# Altium schematic sheet Igniter Outputs.SchDoc: Ravage - Igniter Outputs
size A4; Address1: Drawn By:; Address2: Dan Visser; DocumentNumber: A; Revision: 0.2; SheetNumber: 10; SheetTotal: 15
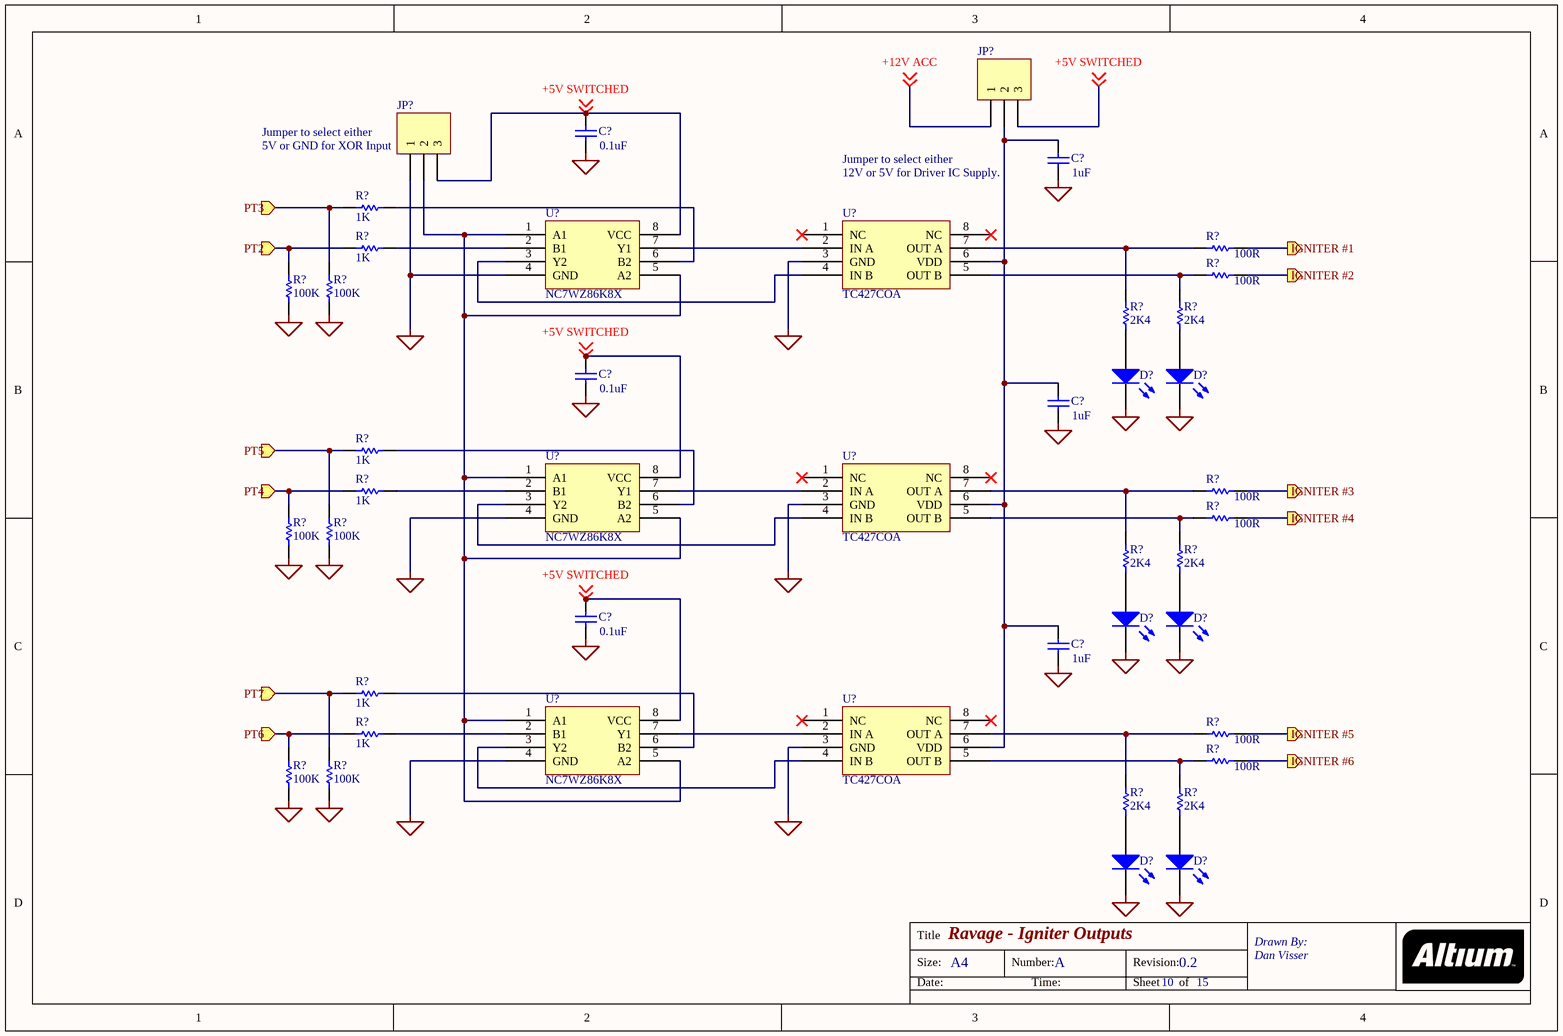
[diagram p0: Igniter Outputs.SchDoc]

## Parts
(Parts that share a designator on the sheet are numbered #1, #2 ... from top to bottom, then left to right.)
C?#1  value 0.1uF  [RAD-0.3]
C?#2  value 1uF  [RAD-0.3]
C?#3  value 0.1uF  [RAD-0.3]
C?#4  value 1uF  [RAD-0.3]
C?#5  value 0.1uF  [RAD-0.3]
C?#6  value 1uF  [RAD-0.3]
D?#1  (no value)  [LED-0]
D?#2  (no value)  [LED-0]
D?#3  (no value)  [LED-0]
D?#4  (no value)  [LED-0]
D?#5  (no value)  [LED-0]
D?#6  (no value)  [LED-0]
JP?#1  (no value)  [HDR1X3]
JP?#2  (no value)  [HDR1X3]
R?#1  value 1K  [AXIAL-0.3]
R?#2  value 100R  [AXIAL-0.3]
R?#3  value 1K  [AXIAL-0.3]
R?#4  value 100R  [AXIAL-0.3]
R?#5  value 100K  [AXIAL-0.3]
R?#6  value 100K  [AXIAL-0.3]
R?#7  value 2K4  [AXIAL-0.3]
R?#8  value 2K4  [AXIAL-0.3]
R?#9  value 1K  [AXIAL-0.3]
R?#10  value 100R  [AXIAL-0.3]
R?#11  value 1K  [AXIAL-0.3]
R?#12  value 100R  [AXIAL-0.3]
R?#13  value 100K  [AXIAL-0.3]
R?#14  value 100K  [AXIAL-0.3]
R?#15  value 2K4  [AXIAL-0.3]
R?#16  value 2K4  [AXIAL-0.3]
R?#17  value 1K  [AXIAL-0.3]
R?#18  value 100R  [AXIAL-0.3]
R?#19  value 1K  [AXIAL-0.3]
R?#20  value 100R  [AXIAL-0.3]
R?#21  value 100K  [AXIAL-0.3]
R?#22  value 100K  [AXIAL-0.3]
R?#23  value 2K4  [AXIAL-0.3]
R?#24  value 2K4  [AXIAL-0.3]
U?#1  TC427COA
U?#2  NC7WZ86K8X
U?#3  TC427COA
U?#4  NC7WZ86K8X
U?#5  TC427COA
U?#6  NC7WZ86K8X

## Ports
IGNITER #1 (out), IGNITER #2 (out), IGNITER #3 (out), IGNITER #4 (out), IGNITER #5 (out), IGNITER #6 (out), PT2 (in), PT3 (in), PT4 (in), PT5 (in), PT6 (in), PT7 (in)

## Nets
NetC?#1_1: C?#1.1 C?#2.1 C?#3.1 C?#4.1 C?#5.1 C?#6.1 D?#1.2(K) D?#2.2(K) D?#3.2(K) D?#4.2(K) D?#5.2(K) D?#6.2(K) JP?#2.1 R?#5.1 R?#6.1 R?#13.1 R?#14.1 R?#21.1 R?#22.1 U?#1.3(GND) U?#2.4(GND) U?#3.3(GND) U?#4.4(GND) U?#5.3(GND) U?#6.4(GND)
+5V SWITCHED: C?#1.2 C?#3.2 C?#5.2 JP?#1.3 JP?#2.3 U?#2.8(VCC) U?#4.8(VCC) U?#6.8(VCC) ; off-sheet +5V SWITCHED
+12V ACC: JP?#1.1 ; off-sheet +12V ACC
IGNITER #1: R?#2.2 ; port IGNITER #1
IGNITER #2: R?#4.2 ; port IGNITER #2
IGNITER #3: R?#10.2 ; port IGNITER #3
IGNITER #4: R?#12.2 ; port IGNITER #4
IGNITER #5: R?#18.2 ; port IGNITER #5
IGNITER #6: R?#20.2 ; port IGNITER #6
PT2: R?#3.2 R?#5.2 ; port PT2
PT3: R?#1.2 R?#6.2 ; port PT3
PT4: R?#11.2 R?#13.2 ; port PT4
PT5: R?#9.2 R?#14.2 ; port PT5
PT6: R?#19.2 R?#21.2 ; port PT6
PT7: R?#17.2 R?#22.2 ; port PT7
NetC?#2_2: C?#2.2 C?#4.2 C?#6.2 JP?#1.2 U?#1.6(VDD) U?#3.6(VDD) U?#5.6(VDD)
NetD?#1_1: D?#1.1(A) R?#7.1
NetD?#2_1: D?#2.1(A) R?#8.1
NetD?#3_1: D?#3.1(A) R?#15.1
NetD?#4_1: D?#4.1(A) R?#16.1
NetD?#5_1: D?#5.1(A) R?#23.1
NetD?#6_1: D?#6.1(A) R?#24.1
NetJP?#2_2: JP?#2.2 U?#2.1(A1) U?#2.5(A2) U?#4.1(A1) U?#4.5(A2) U?#6.1(A1) U?#6.5(A2)
NetR?#1_1: R?#1.1 U?#2.6(B2)
NetR?#2_1: R?#2.1 R?#7.2 U?#1.7(OUT_A)
NetR?#3_1: R?#3.1 U?#2.2(B1)
NetR?#4_1: R?#4.1 R?#8.2 U?#1.5(OUT_B)
NetR?#9_1: R?#9.1 U?#4.6(B2)
NetR?#10_1: R?#10.1 R?#15.2 U?#3.7(OUT_A)
NetR?#11_1: R?#11.1 U?#4.2(B1)
NetR?#12_1: R?#12.1 R?#16.2 U?#3.5(OUT_B)
NetR?#17_1: R?#17.1 U?#6.6(B2)
NetR?#18_1: R?#18.1 R?#23.2 U?#5.7(OUT_A)
NetR?#19_1: R?#19.1 U?#6.2(B1)
NetR?#20_1: R?#20.1 R?#24.2 U?#5.5(OUT_B)
NetU?#1_2: U?#1.2(IN_A) U?#2.7(Y1)
NetU?#1_4: U?#1.4(IN_B) U?#2.3(Y2)
NetU?#3_2: U?#3.2(IN_A) U?#4.7(Y1)
NetU?#3_4: U?#3.4(IN_B) U?#4.3(Y2)
NetU?#5_2: U?#5.2(IN_A) U?#6.7(Y1)
NetU?#5_4: U?#5.4(IN_B) U?#6.3(Y2)

Not connected (* = marked no-connect by the designer): U?#1 1(NC)* 8(NC)*; U?#3 1(NC)* 8(NC)*; U?#5 1(NC)* 8(NC)*

## Notes on the sheet
- (near JP?#2) Jumper to select either
- (near JP?#2) 5V or GND for XOR Input
- Jumper to select either
- (near C?#2) 12V or 5V for Driver IC Supply.
- Title
- Size:
- Date:
- A4
- Number:
- Time:
- Revision:
- Sheet
- of

## Library data of the parts
C?#1-C?#6 = Cap: Capacitor; Published: 8-Jun-2000; LatestRevisionDate: 17-Jul-2002; LatestRevisionNote: Re-released for DXP Platform.; PackageReference: RAD-0.3; Publisher: Altium Limited; PackageDescription: Radial Cap, Thru-Hole; 2 Leads; 0.3 in Pin Spacing
D?#1-D?#6 = LED0: Typical INFRARED GaAs LED; Published: 8-Jun-2000; LatestRevisionDate: 08-Jul-2005; LatestRevisionNote: Mech Layer 1 removed.; PackageReference: LED-0; Publisher: Altium Limited; PackageDescription: LED; 2 Leads
JP?#1 JP?#2 = Header 3: Header, 3-Pin; LatestRevisionDate: 17-Jul-2002; LatestRevisionNote: Re-released for DXP Platform.; Publisher: Altium Limited
R?#1-R?#24 = Res1: Resistor; Published: 8-Jun-2000; LatestRevisionDate: 17-Jul-2002; LatestRevisionNote: Re-released for DXP Platform.; PackageReference: AXIAL-0.3; Publisher: Altium Limited; PackageDescription: Axial Device, Thru-Hole; 2 Leads; 0.3 in Pin Spacing